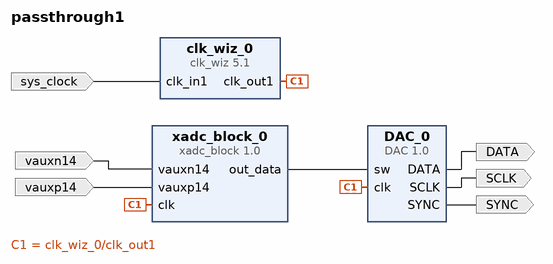
[diagram p0: block diagram of the top level]
# Vivado block design passthrough1, Vivado 2015.1
create_bd_design passthrough1

create_bd_port -dir O SYNC
create_bd_port -dir O DATA
create_bd_port -dir O SCLK
create_bd_port -dir I vauxn14
create_bd_port -dir I vauxp14
create_bd_port -dir I -type clk sys_clock
set_property -dict {CONFIG.FREQ_HZ 100000000 CONFIG.PHASE 0.000} [get_bd_ports sys_clock]

create_bd_cell -type ip -vlnv user.org:user:xadc_block:1.0 xadc_block_0
create_bd_cell -type ip -vlnv user.org:user:DAC:1.0 DAC_0
create_bd_cell -type ip -vlnv xilinx.com:ip:clk_wiz:5.1 clk_wiz_0
set_property -dict {CONFIG.USE_BOARD_FLOW true CONFIG.CLK_IN1_BOARD_INTERFACE sys_clock} [get_bd_cells clk_wiz_0]

# ---- connections ----

connect_bd_net [get_bd_pins DAC_0/SYNC] [get_bd_ports SYNC]
connect_bd_net [get_bd_pins DAC_0/DATA] [get_bd_ports DATA]
connect_bd_net [get_bd_pins DAC_0/SCLK] [get_bd_ports SCLK]
connect_bd_net -net vauxn14_1 [get_bd_ports vauxn14] [get_bd_pins xadc_block_0/vauxn14]
connect_bd_net -net vauxp14_1 [get_bd_ports vauxp14] [get_bd_pins xadc_block_0/vauxp14]
connect_bd_net [get_bd_ports sys_clock] [get_bd_pins clk_wiz_0/clk_in1]
connect_bd_net [get_bd_pins clk_wiz_0/clk_out1] [get_bd_pins xadc_block_0/clk] [get_bd_pins DAC_0/clk]
connect_bd_net [get_bd_pins xadc_block_0/out_data] [get_bd_pins DAC_0/sw]

validate_bd_design
save_bd_design
